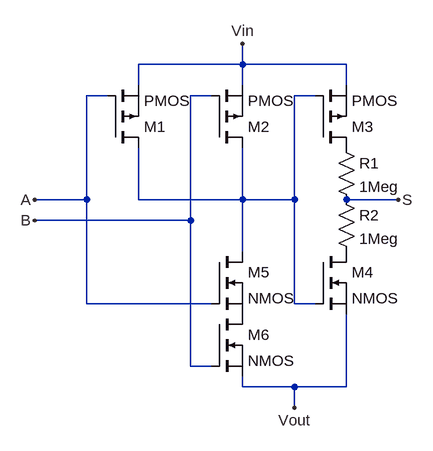
[diagram p0: schematic AND.asc]
AND.asc, the LTspice schematic file:
Version 4
SHEET 1 880 680
WIRE 304 32 304 0
WIRE 304 32 144 32
WIRE 464 32 304 32
WIRE 144 64 144 32
WIRE 304 64 304 32
WIRE 464 64 464 32
WIRE 96 80 64 80
WIRE 256 80 224 80
WIRE 416 80 384 80
WIRE 64 240 64 80
WIRE 64 240 -16 240
WIRE 144 240 144 160
WIRE 304 240 304 160
WIRE 304 240 144 240
WIRE 384 240 384 80
WIRE 384 240 304 240
WIRE 544 240 464 240
WIRE 224 272 224 80
WIRE 224 272 -16 272
WIRE 304 320 304 240
WIRE 64 400 64 240
WIRE 256 400 64 400
WIRE 384 400 384 240
WIRE 416 400 384 400
WIRE 224 496 224 272
WIRE 256 496 224 496
WIRE 304 528 304 512
WIRE 384 528 304 528
WIRE 464 528 464 416
WIRE 464 528 384 528
WIRE 384 560 384 528
FLAG -16 240 A
FLAG -16 272 B
FLAG 304 0 Vin
FLAG 544 240 S
FLAG 384 560 Vout
SYMBOL pmos 96 160 M180
SYMATTR InstName M1
SYMBOL pmos 256 160 M180
SYMATTR InstName M2
SYMBOL pmos 416 160 M180
SYMATTR InstName M3
SYMBOL res 448 144 R0
SYMATTR InstName R1
SYMATTR Value 1Meg
SYMATTR SpiceLine tol=1 pwr=0.1
SYMBOL res 448 224 R0
SYMATTR InstName R2
SYMATTR Value 1Meg
SYMATTR SpiceLine tol=1 pwr=0.1
SYMBOL nmos 416 320 R0
SYMATTR InstName M4
SYMBOL nmos 256 320 R0
SYMATTR InstName M5
SYMBOL nmos 256 416 R0
SYMATTR InstName M6

The netlist it stands for:
* AND.asc
M1 N001 A Vin Vin PMOS
M2 N001 B Vin Vin PMOS
M3 P001 N001 Vin Vin PMOS
R1 P001 S 1Meg tol=1 pwr=0.1
R2 S P002 1Meg tol=1 pwr=0.1
M4 P002 N001 Vout Vout NMOS
M5 N001 A P003 P003 NMOS
M6 P003 B Vout Vout NMOS
.model NMOS NMOS
.model PMOS PMOS
.lib standard.mos
.backanno
.end